# Altium schematic sheet RTU_LMG_Modem.SchDoc
size B; Organization: Altium Limited; Address1: L3, 12a Rodborough Rd; Address2: Frenchs Forest; Address3: NSW; Address4: Australia 2086; SheetNumber: 7; SheetTotal: 16
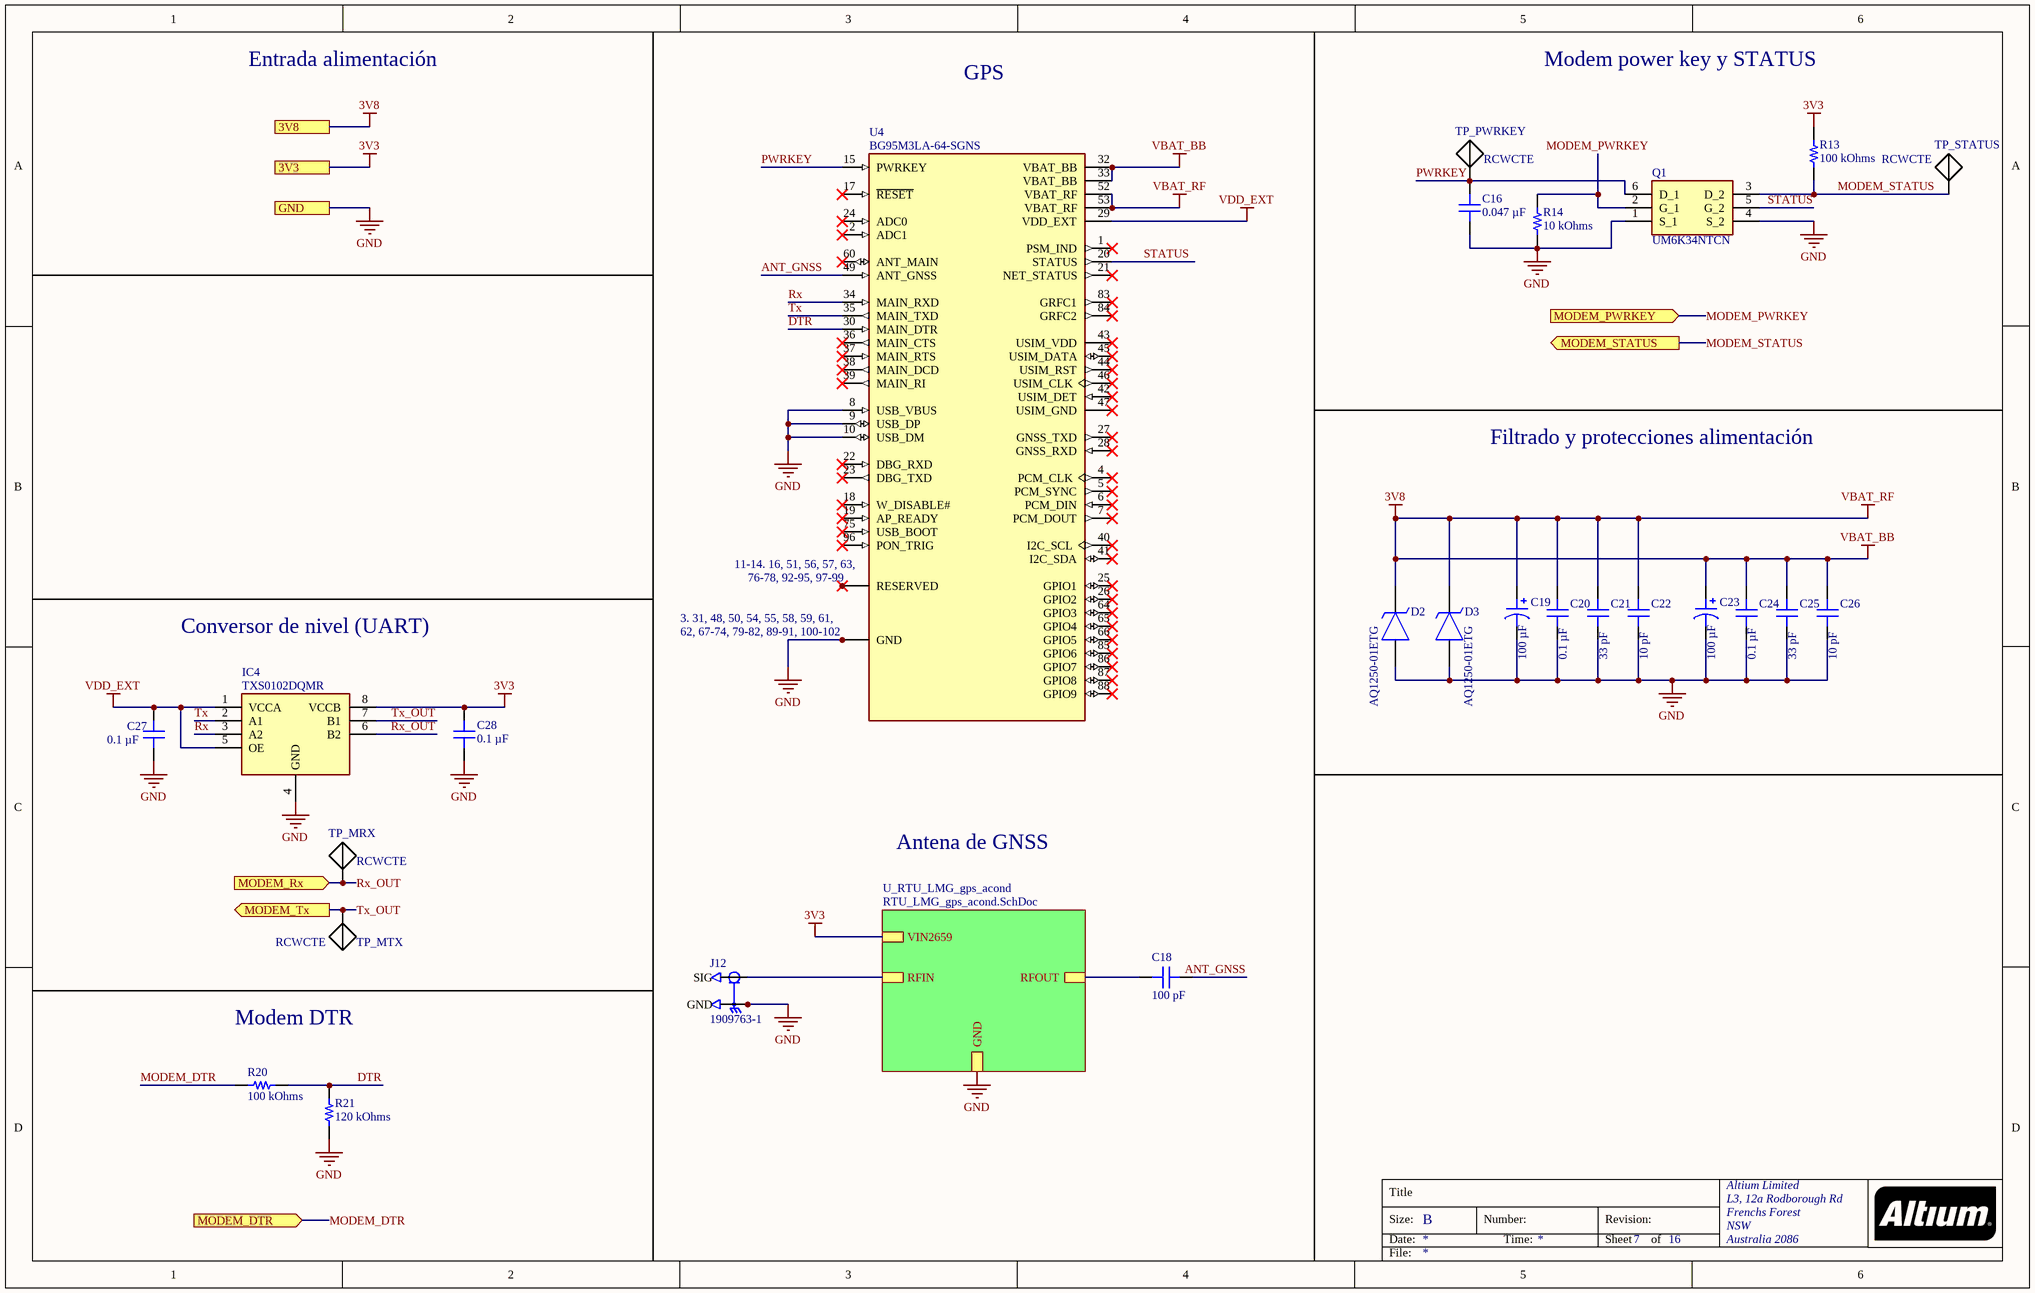
[diagram p0: RTU_LMG_Modem.SchDoc]

## Parts
C16  0.047 µF  [CAP 0603_1608]
C18  100 pF  [CAP 0402_1005]
C19  100 µF  [CAP ALSMD ELEC 6.6MM H5.4MM]
C20  0.1 µF  [CAP 0402_1005]
C21  33 pF  [CAP 0402_1005]
C22  10 pF  [CAP 0402_1005]
C23  100 µF  [CAP ALSMD ELEC 6.6MM H5.4MM]
C24  0.1 µF  [CAP 0402_1005]
C25  33 pF  [CAP 0402_1005]
C26  10 pF  [CAP 0402_1005]
C27  0.1 µF  [CAP 0402_1005]
C28  0.1 µF  [CAP 0402_1005]
D2  AQ1250-01ETG  [SOD-882]
D3  AQ1250-01ETG  [SOD-882]
IC4  TXS0102DQMR  [8-X2SON]
J12  1909763-1  [TE_1909763-1]
Q1  UM6K34NTCN  [SOT-363]
R13  100 kOhms  [RES 0402_1005]
R14  10 kOhms  [RES 0603_1608]
R20  100 kOhms  [RES 0402_1005]
R21  120 kOhms  [RES 0402_1005]
TP_MRX  RCWCTE  [RCWCTE]
TP_MTX  RCWCTE  [RCWCTE]
TP_PWRKEY  RCWCTE  [RCWCTE]
TP_STATUS  RCWCTE  [RCWCTE]
U4  BG95M3LA-64-SGNS  [BG95M3LA-64-SGNS]

## Sub-sheets
U_RTU_LMG_gps_acond = RTU_LMG_gps_acond.SchDoc: VIN2659, GND, RFOUT, RFIN

## Ports
3V3, 3V8, GND, MODEM_DTR (in), MODEM_PWRKEY (in), MODEM_Rx (in), MODEM_STATUS (out), MODEM_Tx (out)

## Nets
3V3: C28.2 IC4.8(VCCB) R13.2 ; port 3V3, sheet U_RTU_LMG_gps_acond/VIN2659
3V8: C19.1 C20.2 C21.1 C22.1 C23.1 C24.2 C25.1 C26.1 D2.1(K) D3.1(K) U4.32(VBAT_BB) U4.33(VBAT_BB) U4.52(VBAT_RF) U4.53(VBAT_RF) ; port 3V8  [also labelled VBAT_BB, VBAT_RF]
GND: C16.1 C19.2 C20.1 C21.2 C22.2 C23.2 C24.1 C25.2 C26.2 C27.1 C28.1 D2.2(A) D3.2(A) IC4.4(GND) J12.2(GND) J12.3(GND) Q1.1(S_1) Q1.4(S_2) R14.2 R21.1 U4.3(GND) U4.8(USB_VBUS) U4.9(USB_DP) U4.10(USB_DM) U4.31(GND) U4.48(GND) U4.50(GND) U4.54(GND) U4.55(GND) U4.58(GND) U4.59(GND) U4.61(GND) U4.62(GND) U4.67(GND) U4.68(GND) U4.69(GND) U4.70(GND) U4.71(GND) U4.72(GND) U4.73(GND) U4.74(GND) U4.79(GND) U4.80(GND) U4.81(GND) U4.82(GND) U4.89(GND) U4.90(GND) U4.91(GND) U4.100(GND) U4.101(GND) U4.102(GND) ; port GND, sheet U_RTU_LMG_gps_acond/GND
VDD_EXT: C27.2 IC4.1(VCCA) IC4.5(OE) U4.29(VDD_EXT)
ANT_GNSS: C18.1 U4.49(ANT_GNSS)
DTR: R20.1 R21.2 U4.30(MAIN_DTR)
MODEM_DTR: R20.2 ; port MODEM_DTR
MODEM_PWRKEY: Q1.2(G_1) R14.1 ; port MODEM_PWRKEY
MODEM_STATUS: Q1.3(D_2) R13.1 TP_STATUS.1(TP) ; port MODEM_STATUS
PWRKEY: C16.2 Q1.6(D_1) TP_PWRKEY.1(TP) U4.15(PWRKEY)
Rx: IC4.3(A2) U4.34(MAIN_RXD)
Rx_OUT: IC4.6(B2) TP_MRX.1(TP) ; port MODEM_Rx
STATUS: Q1.5(G_2) U4.20(STATUS)
Tx: IC4.2(A1) U4.35(MAIN_TXD)
Tx_OUT: IC4.7(B1) TP_MTX.1(TP) ; port MODEM_Tx
NetC18_2: C18.2 ; sheet U_RTU_LMG_gps_acond/RFOUT
NetJ12_1: J12.1(SIG) ; sheet U_RTU_LMG_gps_acond/RFIN
NetU4_11: U4.11(RESERVED) U4.12(RESERVED) U4.13(RESERVED) U4.14(RESERVED) U4.16(RESERVED) U4.51(RESERVED) U4.56(RESERVED) U4.57(RESERVED) U4.63(RESERVED) U4.76(RESERVED) U4.77(RESERVED) U4.78(RESERVED) U4.92(RESERVED) U4.93(RESERVED) U4.94(RESERVED) U4.95(RESERVED) U4.97(RESERVED) U4.98(RESERVED) U4.99(RESERVED)

Not connected (* = marked no-connect by the designer): U4 1(PSM_IND)* 2(ADC1)* 4(PCM_CLK)* 5(PCM_SYNC)* 6(PCM_DIN)* 7(PCM_DOUT)* 17(~{RESET})* 18(W_DISABLE#)* 19(AP_READY)* 21(NET_STATUS)* 22(DBG_RXD)* 23(DBG_TXD)* 24(ADC0)* 25(GPIO1)* 26(GPIO2)* 27(GNSS_TXD)* 28(GNSS_RXD)* 36(MAIN_CTS)* 37(MAIN_RTS)* 38(MAIN_DCD)* 39(MAIN_RI)* 40(I2C_SCL)* 41(I2C_SDA)* 42(USIM_DET)* 43(USIM_VDD)* 44(USIM_RST)* 45(USIM_DATA)* 46(USIM_CLK)* 47(USIM_GND)* 60(ANT_MAIN)* 64(GPIO3)* 65(GPIO4)* 66(GPIO5)* 75(USB_BOOT)* 83(GRFC1)* 84(GRFC2)* 85(GPIO6)* 86(GPIO7)* 87(GPIO8)* 88(GPIO9)* 96(PON_TRIG)*

## Notes on the sheet
- Entrada alimentación
- GPS
- Modem power key y STATUS
- Filtrado y protecciones alimentación
- Conversor de nivel (UART)
- Antena de GNSS
- Modem DTR
- Title
- Size:
- Date:
- B
- Number:
- Time:
- Revision:
- Sheet
- of
- File:
- (in symbol BG95M3LA-64-SGNS) 11-14. 16, 51, 56, 57, 63,; 76-78, 92-95, 97-99; 3. 31, 48, 50, 54, 55, 58, 59, 61,; 62, 67-74, 79-82, 89-91, 100-102

## Library data of the parts
C16 = 885012206118: CAP CER 0.047UF 100V X7R 0603; manufacturer: Würth Elektronik; Tolerance: ±10%; Part Number: 885012206118; Value: 0.047 µF; Applications: General Purpose; Capacitance: 0.047 µF; componentlink1description: Datasheet; componentlink1url: https://katalog.we-online.de/pbs/datasheet/885012206118.pdf; componentlink2description: DigiKey Link; componentlink2url: https://www.digikey.com/en/products/detail/würth-elektronik/885012206118/9346004; Device Package: 0603 (1608 Metric); lastupdated: 10/29/2023 7:09:06 PM; Lifecycle Status: Active; Minimum Order: 1; Mounting Type: Surface Mount, MLCC; Operating Temperature: -55°C ~ 125°C; Package / Case: 0603 (1608 Metric); packaging: TapeAndReel; partid: 11891; Part Status: Active; price: 0.06; series: WCAP-CSGP; Size / Dimension: 0.063" L x 0.031" W (1.60mm x 0.80mm); Supplier 1: DigiKey; Supplier Part Number 1: 732-12192-1-ND; Temperature Coefficient: X7R; Thickness (Max): 0.037" (0.95mm); Voltage - Rated: 100V
C18 = CC0402FRNPO9BN101: CAP CER 100PF 50V C0G/NPO 0402; manufacturer: Yageo; Temperature Coefficient: C0G, NP0; Tolerance: ±1%; Part Number: CC0402FRNPO9BN101; Value: 100 pF; Applications: General Purpose; Capacitance: 100 pF; componentlink1description: Datasheet; componentlink1url: https://www.yageo.com/upload/media/product/productsearch/datasheet/mlcc/UPY-GP_NP0_16V-to-50V_17.pdf; componentlink2description: DigiKey Link; componentlink2url: https://www.digikey.com/en/products/detail/yageo/CC0402FRNPO9BN101/5021207; Device Package: 0402 (1005 Metric); lastupdated: 11/1/2023 7:04:19 PM; Lifecycle Status: Active; Minimum Order: 1; Mounting Type: Surface Mount, MLCC; Operating Temperature: -55°C ~ 125°C; Package / Case: 0402 (1005 Metric); packaging: TapeAndReel; partid: 8397; Part Status: Active; price: 0.01; series: CC; Size / Dimension: 0.039" L x 0.020" W (1.00mm x 0.50mm); Supplier 1: DigiKey; Supplier Part Number 1: 311-3329-1-ND; Thickness (Max): 0.022" (0.55mm); Voltage - Rated: 50V
C19 C23 = 865080343009: CAP ALUM 100UF 20% 16V SMD; manufacturer: Würth Elektronik; Impedance: 520 mOhms; Lifetime @ Temp.: 2000 Hrs @ 105°C; Polarization: Polar; Ripple Current @ High Frequency: 255 mA @ 100 kHz; Ripple Current @ Low Frequency: 165.75 mA @ 120 Hz; Surface Mount Land Size: 0.260" L x 0.260" W (6.60mm x 6.60mm); Part Number: 865080343009; Applications: General Purpose; Capacitance: 100 µF; componentlink1description: Datasheet; componentlink1url: https://katalog.we-online.de/pbs/datasheet/865080343009.pdf; componentlink2description: DigiKey Link; componentlink2url: https://www.digikey.com/en/products/detail/würth-elektronik/865080343009/5728014; Device Package: Radial, Can - SMD; Height - Seated (Max): 0.217" (5.50mm); lastupdated: 10/31/2023 8:16:49 PM; Lifecycle Status: Active; Minimum Order: 1; Mounting Type: Surface Mount; Operating Temperature: -55°C ~ 105°C; Package / Case: Radial, Can - SMD; packaging: TapeAndReel; partid: 8820; Part Status: Active; price: 0.16; series: WCAP-ASLI; Size / Dimension: 0.248" Dia (6.30mm); Supplier 1: DigiKey; Supplier Part Number 1: 732-8419-1-ND; Tolerance: ±20%; value: 100 µF; Voltage - Rated: 16 V
C20 C24 C27 C28 = GRM155R71H104KE14D: CAP CER 0.1UF 50V X7R 0402; manufacturer: Murata Electronics; Tolerance: ±10%; Part Number: GRM155R71H104KE14D; Value: 0.1 µF; Applications: General Purpose; Capacitance: 0.1 µF; componentlink1description: Datasheet; componentlink1url: https://search.murata.co.jp/Ceramy/image/img/A01X/G101/ENG/GRM155R71H104KE14-01.pdf; componentlink2description: DigiKey Link; componentlink2url: https://www.digikey.com/en/products/detail/murata-electronics/GRM155R71H104KE14D/4906220; Device Package: 0402 (1005 Metric); lastupdated: 10/30/2023 7:04:06 PM; Lifecycle Status: Active; Minimum Order: 1; Mounting Type: Surface Mount, MLCC; Operating Temperature: -55°C ~ 125°C; Package / Case: 0402 (1005 Metric); packaging: CutTape; partid: 12677; Part Status: Active; price: 0.01; series: GRM; Size / Dimension: 0.039" L x 0.020" W (1.00mm x 0.50mm); Supplier 1: DigiKey; Supplier Part Number 1: 490-10700-1-ND; Temperature Coefficient: X7R; Thickness (Max): 0.022" (0.55mm); Voltage - Rated: 50V
C21 C25 = CC0402GRNPO9BN330: CAP CER 33PF 50V C0G/NPO 0402; manufacturer: Yageo; Temperature Coefficient: C0G, NP0; Tolerance: ±2%; Part Number: CC0402GRNPO9BN330; Value: 33 pF; Applications: General Purpose; Capacitance: 33 pF; componentlink1description: Datasheet; componentlink1url: https://www.yageo.com/upload/media/product/productsearch/datasheet/mlcc/UPY-GP_NP0_16V-to-50V_17.pdf; componentlink2description: DigiKey Link; componentlink2url: https://www.digikey.com/en/products/detail/yageo/CC0402GRNPO9BN330/5195063; Device Package: 0402 (1005 Metric); lastupdated: 11/1/2023 7:04:30 PM; Lifecycle Status: Active; Minimum Order: 1; Mounting Type: Surface Mount, MLCC; Operating Temperature: -55°C ~ 125°C; Package / Case: 0402 (1005 Metric); packaging: TapeAndReel; partid: 1910; Part Status: Active; price: 0.01; series: CC; Size / Dimension: 0.039" L x 0.020" W (1.00mm x 0.50mm); Supplier 1: DigiKey; Supplier Part Number 1: 311-1654-1-ND; Thickness (Max): 0.022" (0.55mm); Voltage - Rated: 50V
C22 C26 = CC0402DRNPO9BN100: CAP CER 10PF 50V C0G/NPO 0402; manufacturer: Yageo; Temperature Coefficient: C0G, NP0; Tolerance: ±0.5pF; Part Number: CC0402DRNPO9BN100; Value: 10 pF; Applications: General Purpose; Capacitance: 10 pF; componentlink1description: Datasheet; componentlink1url: https://www.yageo.com/upload/media/product/productsearch/datasheet/mlcc/UPY-GP_NP0_16V-to-50V_17.pdf; componentlink2description: DigiKey Link; componentlink2url: https://www.digikey.com/en/products/detail/yageo/CC0402DRNPO9BN100/2297890; Device Package: 0402 (1005 Metric); lastupdated: 11/1/2023 7:04:26 PM; Lifecycle Status: Active; Minimum Order: 1; Mounting Type: Surface Mount, MLCC; Operating Temperature: -55°C ~ 125°C; Package / Case: 0402 (1005 Metric); packaging: CutTape; partid: 3899; Part Status: Active; price: 0.01; series: CC; Size / Dimension: 0.039" L x 0.020" W (1.00mm x 0.50mm); Supplier 1: DigiKey; Supplier Part Number 1: 311-3651-1-ND; Thickness (Max): 0.022" (0.55mm); Voltage - Rated: 50V
D2 D3 = AQ1250-01ETG: TVS Diode (Uni-directional) - VRMW =5V - VBR = 5.5 V; Manufacturer_Name: LITTELFUSE; Datasheet Link: https://www.littelfuse.com/~/media/electronics/datasheets/tvs_diode_arrays/littelfuse_tvs_diode_array_aq1250-01etg_datasheet.pdf.pdf; Height: 0.55mm; Manufacturer_Part_Number: AQ1250-01ETG; Mouser Part Number: 576-AQ1250-01ETG; Mouser Price/Stock: https://www.mouser.co.uk/ProductDetail/Littelfuse/AQ1250-01ETG?qs=iLbezkQI%252BsgYBFHNQL11bg%3D%3D
IC4 = TXS0102DQMR: Conversor de nivel lógico bidireccional 1.8-3.3 V; Manufacturer_Name: Texas Instruments; Datasheet Link: http://www.ti.com/lit/gpn/txs0102; Height: 0.4mm; Manufacturer_Part_Number: TXS0102DQMR; Mouser Part Number: 595-TXS0102DQMR; Mouser Price/Stock: https://www.mouser.co.uk/ProductDetail/Texas-Instruments/TXS0102DQMR?qs=l3GMcByk76LwJNFmr1RbWA%3D%3D; Arrow Part Number: TXS0102DQMR; Arrow Price/Stock: https://www.arrow.com/en/products/txs0102dqmr/texas-instruments?region=nac
J12 = 1909763-1: Conector antena Coaxial PL 50Ohm Solder ST SMD Gold Over Nickel T/R; MF: TE Connectivity; Purchase-URL: https://pricing.snapeda.com/search/part/1909763-1/?ref=eda; Package: None; Check_prices: https://www.snapeda.com/parts/1909763-1/TE+Connectivity+AMP+Connectors/view-part/?ref=eda; Value: *; SnapEDA_Link: https://www.snapeda.com/parts/1909763-1/TE+Connectivity+AMP+Connectors/view-part/?ref=snap; MP: 1909763-1; Digi-Key_Part_Number: A118077TR-ND
Q1 = UM6K34NTCN: Array 2 MOSFET (N-Channel); Manufacturer_Name: ROHM Semiconductor; Datasheet Link: https://datasheet.datasheetarchive.com/originals/distributors/DKDS-18/357292.pdf; Height: 1mm; Manufacturer_Part_Number: UM6K34NTCN; Mouser Part Number: 755-UM6K34NTCN; Mouser Price/Stock: https://www.mouser.co.uk/ProductDetail/ROHM-Semiconductor/UM6K34NTCN?qs=npTsUczJOtMIn9jsho046Q%3D%3D
R13 R20 = CRCW0402100KFKED: RES SMD 100K OHM 1% 1/16W 0402; Manufacturer: Vishay Dale; Power (Watts): 0.063W, 1/16W; Temperature Coefficient: ±100ppm/°C; Part Number: CRCW0402100KFKED; Value: 100 kOhms; ComponentLink1Description: Datasheet; ComponentLink1URL: http://www.vishay.com/docs/20035/dcrcwe3.pdf; ComponentLink2Description: DigiKey Link; ComponentLink2URL: https://www.digikey.com/en/products/detail/vishay-dale/CRCW0402100KFKED/1178235; Composition: Thick Film; Device Package: 0402 (1005 Metric); Features: Automotive AEC-Q200; Height - Seated (Max): 0.016" (0.40mm); LastUpdated: 11/1/2023 7:27:47 PM; Lifecycle Status: Active; Minimum Order: 1; Number of Terminations: 2; Operating Temperature: -55°C ~ 155°C; Package / Case: 0402 (1005 Metric); Packaging: CutTape; PartId: 11959; Part Status: Active; Price: 0.01; Ratings: AEC-Q200; Resistance: 100 kOhms; Series: CRCW; Size / Dimension: 0.039" L x 0.020" W (1.00mm x 0.50mm); Supplier 1: DigiKey; Supplier Part Number 1: 541-100KLCT-ND; Supplier Device Package: 0402; Tolerance: ±1%
R14 = RC0603FR-0710KL: RES 10K OHM 1% 1/10W 0603; Manufacturer: Yageo; Power (Watts): 0.1W, 1/10W; Temperature Coefficient: ±100ppm/°C; Part Number: RC0603FR-0710KL; Value: 10 kOhms; ComponentLink1Description: Datasheet; ComponentLink1URL: https://www.yageo.com/upload/media/product/productsearch/datasheet/rchip/PYu-RC_Group_51_RoHS_L_10.pdf; ComponentLink2Description: DigiKey Link; ComponentLink2URL: https://www.digikey.com/en/products/detail/yageo/RC0603FR-0710KL/726880; Composition: Thick Film; Device Package: 0603 (1608 Metric); Features: Moisture Resistant; Height - Seated (Max): 0.022" (0.55mm); LastUpdated: 10/30/2023 7:36:43 PM; Lifecycle Status: Active; Minimum Order: 1; Number of Terminations: 2; Operating Temperature: -55°C ~ 155°C; Package / Case: 0603 (1608 Metric); Packaging: CutTape; PartId: 22599; Part Status: Active; Price: 0.01; Resistance: 10 kOhms; Series: RC_L; Size / Dimension: 0.063" L x 0.031" W (1.60mm x 0.80mm); Supplier 1: DigiKey; Supplier Part Number 1: 311-10.0KHRCT-ND; Supplier Device Package: 0603; Tolerance: ±1%
R21 = RMCF0402FT120K: RES 120K OHM 1% 1/16W 0402; Manufacturer: Stackpole Electronics Inc; Power (Watts): 0.063W, 1/16W; Temperature Coefficient: ±100ppm/°C; Part Number: RMCF0402FT120K; Value: 120 kOhms; ComponentLink1Description: Datasheet; ComponentLink1URL: https://www.seielect.com/catalog/sei-rmcf_rmcp.pdf; ComponentLink2Description: DigiKey Link; ComponentLink2URL: https://www.digikey.com/en/products/detail/stackpole-electronics-inc/RMCF0402FT120K/1761420; Composition: Thick Film; Device Package: 0402 (1005 Metric); Features: Automotive AEC-Q200; Height - Seated (Max): 0.016" (0.40mm); LastUpdated: 11/1/2023 7:28:14 PM; Lifecycle Status: Active; Minimum Order: 1; Number of Terminations: 2; Operating Temperature: -55°C ~ 155°C; Package / Case: 0402 (1005 Metric); Packaging: CutTape; PartId: 5008; Part Status: Active; Price: 0.01; Ratings: AEC-Q200; Resistance: 120 kOhms; Series: RMCF; Size / Dimension: 0.039" L x 0.020" W (1.00mm x 0.50mm); Supplier 1: DigiKey; Supplier Part Number 1: RMCF0402FT120KCT-ND; Supplier Device Package: 0402; Tolerance: ±1%
TP_MRX TP_MTX TP_PWRKEY TP_STATUS = RCWCTE: - PC Test Point - - Plating Surface Mount Mounting Type; MF: KOA Speer; Check_prices: https://www.snapeda.com/parts/RCWCTE/KOA+Speer/view-part/?ref=eda; SnapEDA_Link: https://www.snapeda.com/parts/RCWCTE/KOA+Speer/view-part/?ref=snap; Digi-Key_Part_Number: 2019-RCWCTETR-ND; Value: *; Purchase-URL: https://pricing.snapeda.com/search/part/RCWCTE/?ref=eda; Package: None; MP: RCWCTE
U4 = BG95M3LA-64-SGNS: Quectel BG95 Series LTE Cat M1/ Cat NB2/ EGPRS Module; MF: Quectel Wireless Solutions Co., Ltd; Purchase-URL: https://pricing.snapeda.com/search/part/BG95M3LA-64-SGNS/?ref=eda; Digi-Key_Part_Number: 2958-BG95M3LA-64-SGNSCT-ND; Check_prices: https://www.snapeda.com/parts/BG95M3LA-64-SGNS/Quectel/view-part/?ref=eda; Value: *; MP: BG95M3LA-64-SGNS; Package: Non-Standard Quectel; SnapEDA_Link: https://www.snapeda.com/parts/BG95M3LA-64-SGNS/Quectel/view-part/?ref=snap